# Altium project FT4232_mainboard.PrjPcb
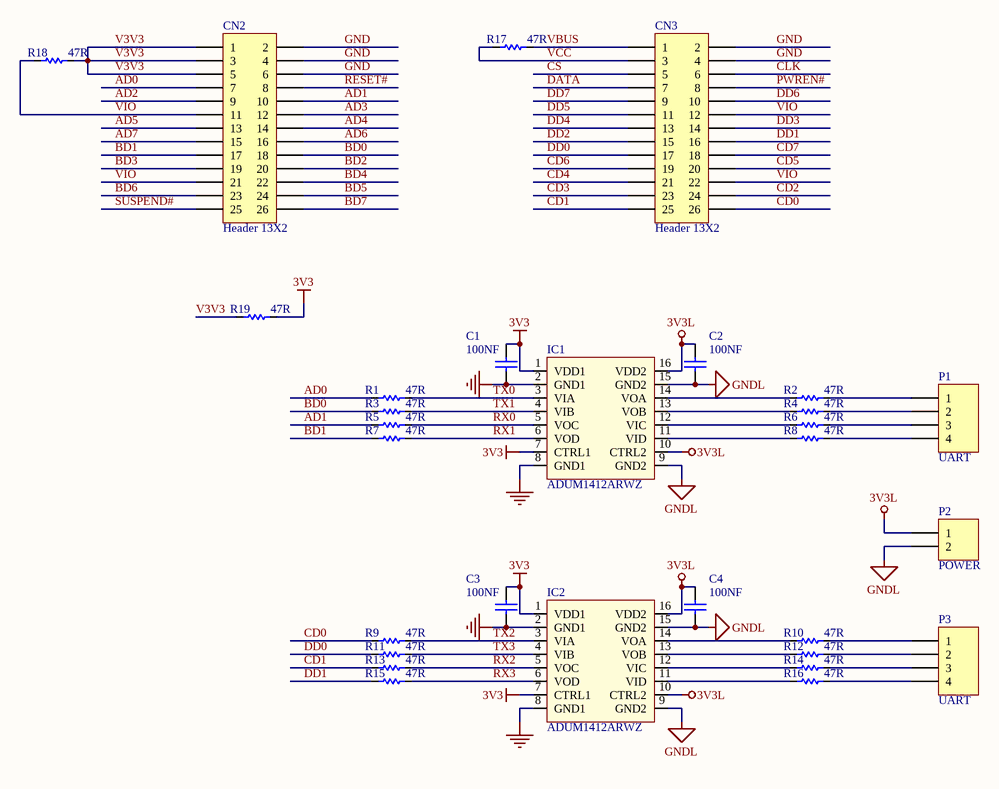
[diagram p0: FT4232_MINI.SchDoc]
1 sheet, 30 parts. Net scope: global (net labels, ports and power ports of the same name join across sheets).
Board file: FT4232_MINI.PcbDoc

## Sheet FT4232_MINI.SchDoc
size A4

### Parts
C1  100NF  [CAPC1608X09N]
C2  100NF  [CAPC1608X09N]
C3  100NF  [CAPC1608X09N]
C4  100NF  [CAPC1608X09N]
CN2  Header 13X2  [Pin Header 2x13 TH Pitch 2.54mm]
CN3  Header 13X2  [Pin Header 2x13 TH Pitch 2.54mm]
IC1  ADUM1412ARWZ  [SOIC127P1030X265-16N]
IC2  ADUM1412ARWZ  [SOIC127P1030X265-16N]
P1  UART  [Klemens-3.81mm-4H]
P2  POWER  [Klemens-3.81mm-2H]
P3  UART  [Klemens-3.81mm-4H]
R1  47R  [RESC1608X06N]
R2  47R  [RESC1608X06N]
R3  47R  [RESC1608X06N]
R4  47R  [RESC1608X06N]
R5  47R  [RESC1608X06N]
R6  47R  [RESC1608X06N]
R7  47R  [RESC1608X06N]
R8  47R  [RESC1608X06N]
R9  47R  [RESC1608X06N]
R10  47R  [RESC1608X06N]
R11  47R  [RESC1608X06N]
R12  47R  [RESC1608X06N]
R13  47R  [RESC1608X06N]
R14  47R  [RESC1608X06N]
R15  47R  [RESC1608X06N]
R16  47R  [RESC1608X06N]
R17  47R  [RESC1608X06N]
R18  47R  [RESC1608X06N]
R19  47R  [RESC1608X06N]

### Nets
3V3: C1.2 C3.2 IC1.1(VDD1) IC1.7(CTRL1) IC2.1(VDD1) IC2.7(CTRL1) R19.2
3V3L: C2.2 C4.2 IC1.10(CTRL2) IC1.16(VDD2) IC2.10(CTRL2) IC2.16(VDD2) P2.1
GND: C1.1 C3.1 CN2.2 CN2.4 CN2.6 CN3.2 CN3.4 IC1.2(GND1) IC1.8(GND1) IC2.2(GND1) IC2.8(GND1)
GNDL: C2.1 C4.1 IC1.9(GND2) IC1.15(GND2) IC2.9(GND2) IC2.15(GND2) P2.2
AD0: CN2.7 R1.1
AD1: CN2.10 R5.1
AD2: CN2.9
AD3: CN2.12
AD4: CN2.14
AD5: CN2.13
AD6: CN2.16
AD7: CN2.15
BD0: CN2.18 R3.1
BD1: CN2.17 R7.1
BD2: CN2.20
BD3: CN2.19
BD4: CN2.22
BD5: CN2.24
BD6: CN2.23
BD7: CN2.26
CD0: CN3.26 R9.1
CD1: CN3.25 R13.1
CD2: CN3.24
CD3: CN3.23
CD4: CN3.21
CD5: CN3.20
CD6: CN3.19
CD7: CN3.18
CLK: CN3.6
CS: CN3.5
DATA: CN3.7
DD0: CN3.17 R11.1
DD1: CN3.16 R15.1
DD2: CN3.15
DD3: CN3.14
DD4: CN3.13
DD5: CN3.11
DD6: CN3.10
DD7: CN3.9
PWREN#: CN3.8
RESET#: CN2.8
RX0: IC1.5(VOC) R5.2
RX1: IC1.6(VOD) R7.2
RX2: IC2.5(VOC) R13.2
RX3: IC2.6(VOD) R15.2
SUSPEND#: CN2.25
TX0: IC1.3(VIA) R1.2
TX1: IC1.4(VIB) R3.2
TX2: IC2.3(VIA) R9.2
TX3: IC2.4(VIB) R11.2
V3V3: CN2.1 CN2.3 CN2.5 R18.2 R19.1
VBUS: CN3.1 R17.2
VCC: CN3.3 R17.1
VIO: CN2.11 CN2.21 CN3.12 CN3.22 R18.1
NetIC1_11: IC1.11(VID) R8.1
NetIC1_12: IC1.12(VIC) R6.1
NetIC1_13: IC1.13(VOB) R4.1
NetIC1_14: IC1.14(VOA) R2.1
NetIC2_11: IC2.11(VID) R16.1
NetIC2_12: IC2.12(VIC) R14.1
NetIC2_13: IC2.13(VOB) R12.1
NetIC2_14: IC2.14(VOA) R10.1
NetP1_1: P1.1 R2.2
NetP1_2: P1.2 R4.2
NetP1_3: P1.3 R6.2
NetP1_4: P1.4 R8.2
NetP3_1: P3.1 R10.2
NetP3_2: P3.2 R12.2
NetP3_3: P3.3 R14.2
NetP3_4: P3.4 R16.2

### Notes on the sheet
- Sheet
- Name:
- Product
- PCB
- Semi
- Code:
- Code-Rev:
- Date:
- Design:
- Approved by:
- PAGE

### Library data of the parts
C1-C4 = 265702: CAP CERAMIC 100NF 50VDC 10% SMD 0603   X7R; STOK KODU: 265702; KILIF: 0603; SINIF: CAP; TIPI: CERAMIC; Value: 100NF; GERİLİM: 50VDC; TOLERANS: 10%; MONTAJ: SMD; EK: X7R; ComponentLink1Description: SAMSUNG_CL10B104KB8NNC; ComponentLink1URL: \\vikoonline\TPM-ARGE\AR-GE\DATA SHEET\265702_CAP_SAMSUNG_CL10B104KB8NNC.pdf
CN2 CN3 = Header 13X2: Header, 13-Pin, Dual row; LatestRevisionDate: 17-Jul-2002; LatestRevisionNote: Re-released for DXP Platform.; Publisher: Altium Limited
IC1 IC2 = 269900: IC DIGITAL ISOLATOR ADUM1412ARWZ 4 CH SMD SOIC16-W; STOK KODU: 269900; CPU: 4 CH; SINIF: IC; TIPI: DIGITAL ISOLATOR; Value: ADUM1412ARWZ; MONTAJ: SMD; KILIF: SOIC16-W; ComponentLink1Description: Datasheet; ComponentLink1URL: https://www.google.com.tr/search?q=ADUM1412ARWZ
P1 P3 = Header 4: Header, 4-Pin; LatestRevisionDate: 17-Jul-2002; LatestRevisionNote: Re-released for DXP Platform.; Publisher: Altium Limited
P2 = Header 2: Header, 2-Pin; LatestRevisionDate: 17-Jul-2002; LatestRevisionNote: Re-released for DXP Platform.; Publisher: Altium Limited
R1-R19 = 266551: RES CARBON 47R 0.1W 1% 100ppm SMD 0603; STOK KODU: 266551; KILIF: 0603; SINIF: RES; TIPI: CARBON; Value: 47R; GÜÇ: 0.1W; TOLERANS: 1%; SICAKLIK KATSAYISI: 100ppm; MONTAJ: SMD; ComponentLink1URL: \\vikoonline\TPM-ARGE\AR-GE\DATA SHEET\; ComponentLink2URL: \\vikoonline\TPM-ARGE\AR-GE\DATA SHEET\